# EAGLE schematic alltogether_8.2_4w (EAGLE 9.1.0), part 3 of 3
## Sheet 29 of 31
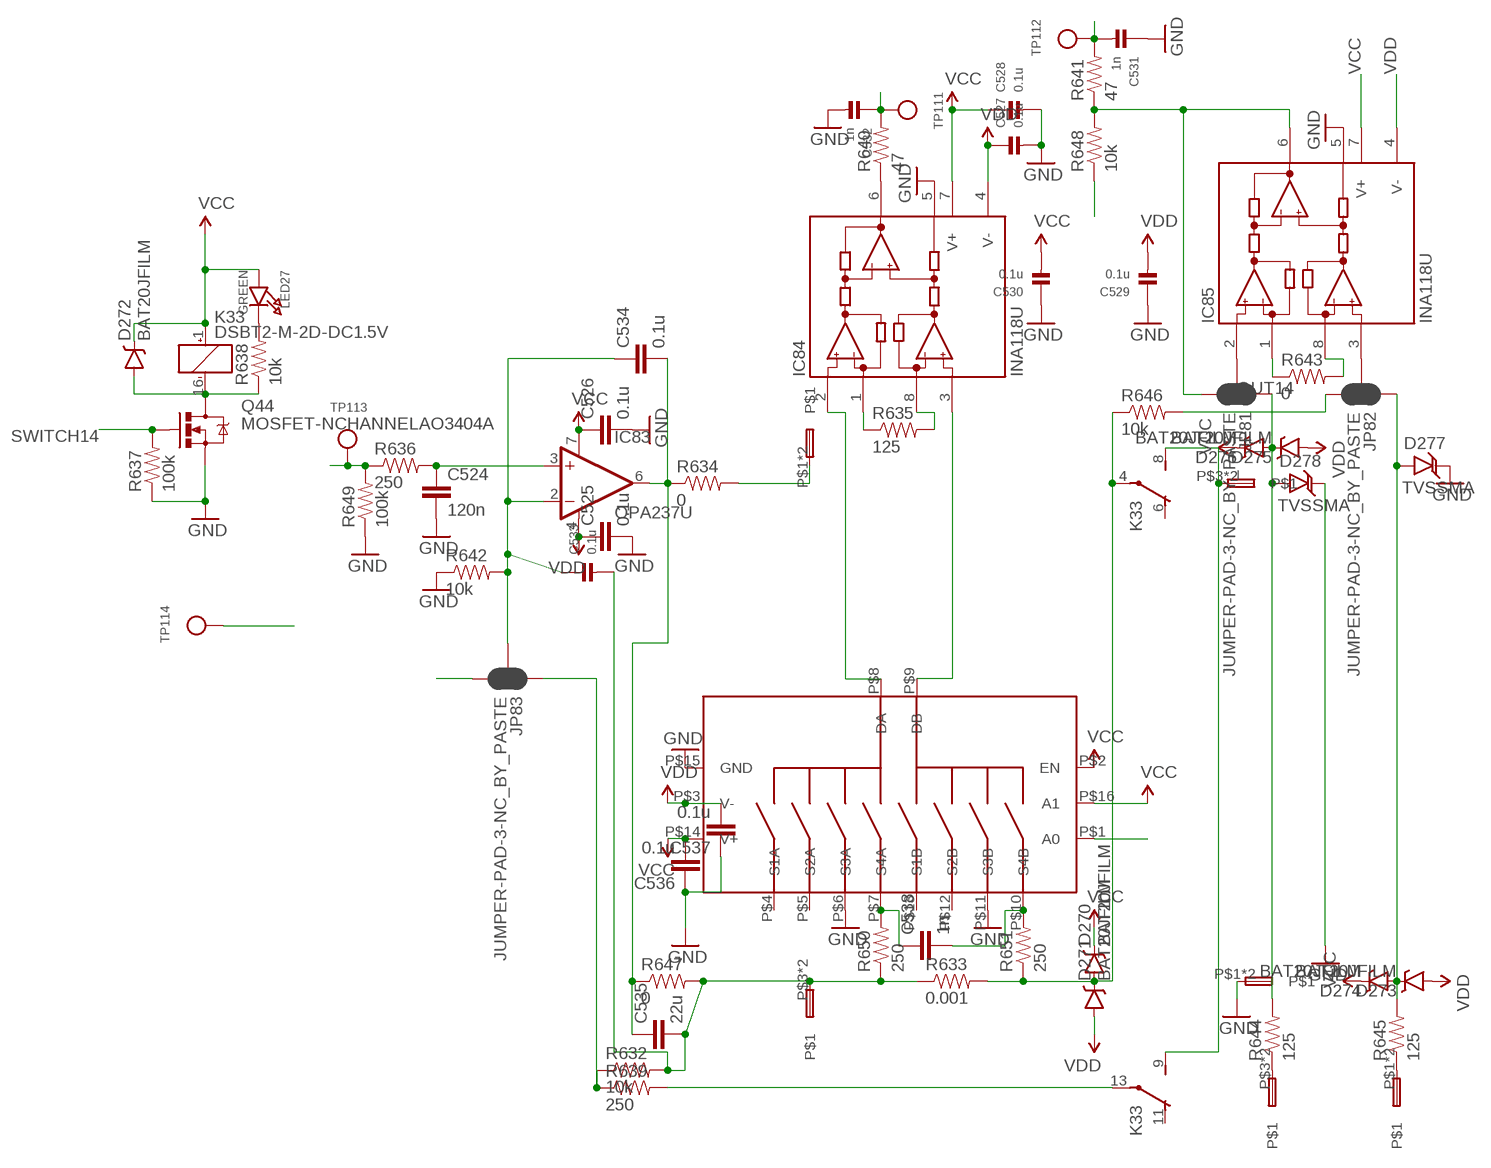
[diagram p28: schematic, sheet 29]

### Parts
C524  120n  CAP0402-CAP  [0402-CAP]
C525  0.1u  CAP0402-CAP  [0402-CAP]
C526  0.1u  CAP0402-CAP  [0402-CAP]
C527  0.1u  CAP_CERAMIC0402  [0402]
C528  0.1u  CAP_CERAMIC0402  [0402]
C529  0.1u  CAP_CERAMIC0402  [0402]
C530  0.1u  CAP_CERAMIC0402  [0402]
C531  1n  CAP_CERAMIC0402  [0402]
C532  1n  CAP_CERAMIC0402  [0402]
C533  0.1u  CAP_CERAMIC0402  [0402]
C534  0.1u  CAP0603-CAP  [0603-CAP]
C535  22u  CAP0805  [0805]
C536  0.1u  CAP0402-CAP  [0402-CAP]
C537  0.1u  CAP0402-CAP  [0402-CAP]
C538  1n  CAP0402-CAP  [0402-CAP]
D270  BAT20JFILM  [SOD-323]
D271  BAT20JFILM  [SOD-323]
D272  BAT20JFILM  [SOD-323]
D273  BAT20JFILM  [SOD-323]
D274  BAT20JFILM  [SOD-323]
D275  BAT20JFILM  [SOD-323]
D276  BAT20JFILM  [SOD-323]
D277  TVSSMA  [SMA-DIODE]
D278  TVSSMA  [SMA-DIODE]
IC83  OPA237U  [SO08]
IC84  INA118U  [SO08]
IC85  INA118U  [SO08]
JP81  JUMPER-PAD-3-NC_BY_PASTE  [PAD-JUMPER-3-NC_BY_PASTE_YES_SILK_FULL_BOX]
JP82  JUMPER-PAD-3-NC_BY_PASTE  [PAD-JUMPER-3-NC_BY_PASTE_YES_SILK_FULL_BOX]
JP83  JUMPER-PAD-3-NC_BY_PASTE  [PAD-JUMPER-3-NC_BY_PASTE_YES_SILK_FULL_BOX]
K33  DSBT2-M-2D-DC1.5V  [DS-BT]
LED27  GREEN  LED0603  [CHIPLED_0603]
Q44  MOSFET-NCHANNELAO3404A  [SOT23-3]
R632  10k  RESISTOR0402-RES  [0402-RES]
R633  0.001  0.001OHM-3W-1%(2512)3W/1%  [2512]
R634  0  RESISTOR0402-RES  [0402-RES]
R635  125  RESISTOR1206  [1206]
R636  250  RESISTOR0402-RES  [0402-RES]
R637  100k  RESISTOR0402-RES  [0402-RES]
R638  10k  RESISTOR0402-RES  [0402-RES]
R639  250  RESISTOR0402-RES  [0402-RES]
R640  47  RESISTOR0402-RES  [0402-RES]
R641  47  RESISTOR0402-RES  [0402-RES]
R642  10k  RESISTOR0402-RES  [0402-RES]
R643  0  RESISTOR1206  [1206]
R644  125  RESISTOR0402-RES  [0402-RES]
R645  125  RESISTOR0402-RES  [0402-RES]
R646  10k  RESISTOR0402-RES  [0402-RES]
R647  0  RESISTOR0805-RES  [0805]
R648  10k  RESISTOR0402-RES  [0402-RES]
R649  100k  RESISTOR0402-RES  [0402-RES]
R650  250  RESISTOR0402-RES  [0402-RES]
R651  250  RESISTOR0402-RES  [0402-RES]
TP111  TESTPOINT0.1"  [1X01_ROUND]
TP112  TESTPOINT0.1"  [1X01_ROUND]
TP113  TESTPOINT0.1"  [1X01_ROUND]
TP114  TESTPOINT0.1"  [1X01_ROUND]
U$119  SPTAF1/2-3.5  [SPTAF1/2-3.5]
U$120  SPTAF1/2-3.5  [SPTAF1/2-3.5]
U$121  SPTAF1/2-3.5  [SPTAF1/2-3.5]
U$122  MUX509  [R-PDSO-G16]

### Nets
A0: TP114.1 U$122.P$1(A0) ; also sheet 2,16,17,18,19,20,21,22,23,24,25,26,27,28,30,31
DAC14: R636.1 R649.2 TP113.1 ; also sheet 9
FB14: JP83.3 R648.1
GND: C524.2 C525.2 C526.2 C527.2 C528.2 C529.1 C530.1 C531.1 C532.2 C536.1 C537.1 D277.C D278.C IC84.5(REF) IC85.5(REF) Q44.2(S) R637.1 R642.1 R649.1 U$120.P$1 U$120.P$2 U$122.P$6(S3A) U$122.P$11(S3B) U$122.P$15(GND) ; also sheet 1,2,3,4,5,6,7,8,9,10,11,12,13,15,16,17,18,19,20,21,22,23,24,25,26,27,28,30,31
N$845: D270.A D271.C K33.4(2:P) R633.2 R646.1 R651.1
N$846: K33.13(3:P) R639.2
N$847: IC84.1(RG) R635.1
N$848: IC84.8(RG) R635.2
N$849: C524.1 IC83.3(+IN) R636.2
N$850: D272.A K33.16(1:-) Q44.3(D) R638.1
N$851: LED27.C R638.2
N$852: C533.1 C534.1 IC83.2(-IN) JP83.2 R642.2
N$853: C533.2 C535.2 R632.2 R633.1 R647.2 R650.1 U$119.P$3 U$119.P$4
N$854: IC84.6(OUT) R640.1
N$855: IC85.6(OUT) JP81.3 R641.1 R648.2
N$856: C534.2 C535.1 IC83.6(OUT) R634.1 R647.1
N$857: IC85.1(RG) R643.1
N$858: IC85.8(RG) R643.2
N$859: IC85.2(-IN) JP81.2
N$860: IC85.3(+IN) JP82.2
N$861: D275.C D276.A D278.A JP81.1 R644.2
N$862: R644.1 U$121.P$3 U$121.P$4
N$863: D273.C D274.A D277.A JP82.1 R645.2
N$864: R645.1 U$121.P$1 U$121.P$2
N$865: JP82.3 R646.2
N$866: JP83.1 R632.1 R639.1
N$867: R634.2 U$119.P$1 U$119.P$2
N$868: IC84.2(-IN) U$122.P$8(DA)
N$869: IC84.3(+IN) U$122.P$9(DB)
N$870: C538.2 R651.2 U$122.P$10(S4B)
N$871: C538.1 R650.2 U$122.P$7(S4A)
OUT14: K33.8(2:S) K33.9(3:S) U$120.P$3 U$120.P$4
SENSEI14: C532.1 R640.2 TP111.1 ; also sheet 7
SENSEV14: C531.2 R641.2 TP112.1 ; also sheet 7
SWITCH14: Q44.1(G) R637.2 ; also sheet 6
VCC: C526.1 C528.1 C530.2 C536.2 D270.C D272.C D274.C D276.C IC83.7(V+) IC84.7(V+) IC85.7(V+) K33.1(1:+) LED27.A U$122.P$2(EN) U$122.P$14(V+) U$122.P$16(A1) ; also sheet 1,2,3,7,8,11,13,15,16,17,18,19,20,21,22,23,24,25,26,27,28,30,31
VDD: C525.1 C527.1 C529.2 C537.2 D271.A D273.A D275.A IC83.4(V-) IC84.4(V-) IC85.4(V-) U$122.P$3(V-) ; also sheet 1,3,7,8,15,16,17,18,19,20,21,22,23,24,25,26,27,28,30,31
Unconnected: K33.6(2:O) K33.11(3:O) U$122.P$4(S1A) U$122.P$5(S2A) U$122.P$12(S2B) U$122.P$13(S1B)

## Sheet 30 of 31
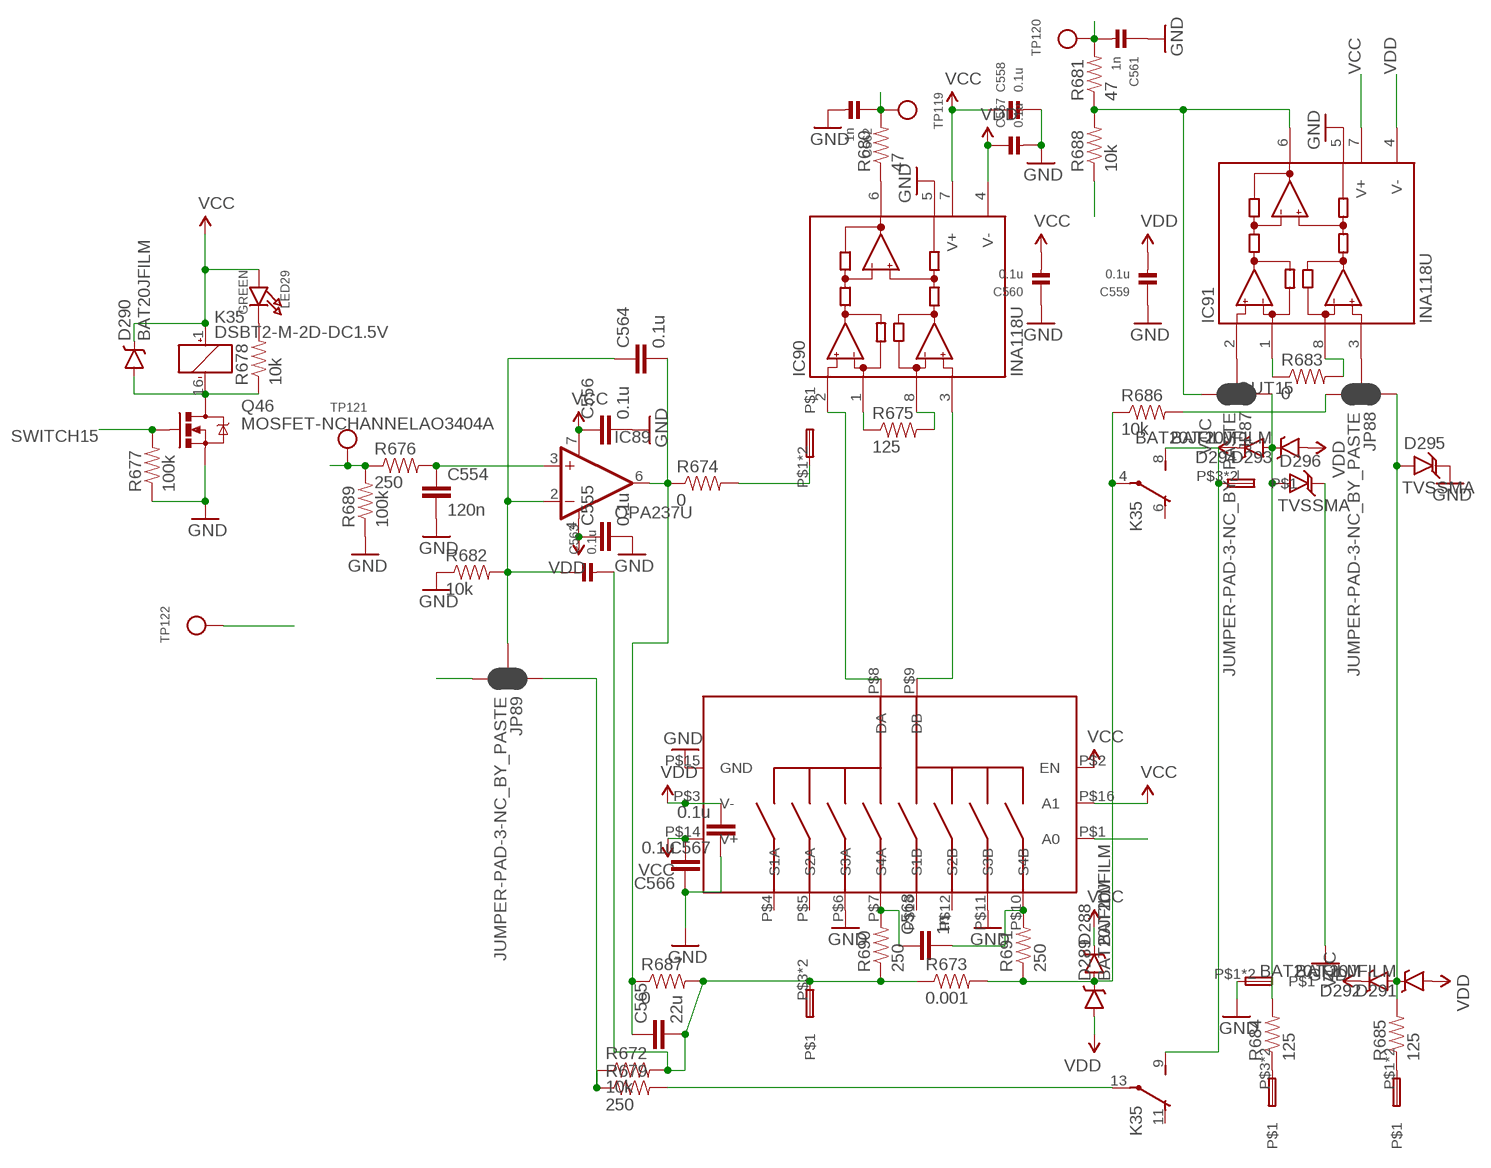
[diagram p29: schematic, sheet 30]

### Parts
C554  120n  CAP0402-CAP  [0402-CAP]
C555  0.1u  CAP0402-CAP  [0402-CAP]
C556  0.1u  CAP0402-CAP  [0402-CAP]
C557  0.1u  CAP_CERAMIC0402  [0402]
C558  0.1u  CAP_CERAMIC0402  [0402]
C559  0.1u  CAP_CERAMIC0402  [0402]
C560  0.1u  CAP_CERAMIC0402  [0402]
C561  1n  CAP_CERAMIC0402  [0402]
C562  1n  CAP_CERAMIC0402  [0402]
C563  0.1u  CAP_CERAMIC0402  [0402]
C564  0.1u  CAP0603-CAP  [0603-CAP]
C565  22u  CAP0805  [0805]
C566  0.1u  CAP0402-CAP  [0402-CAP]
C567  0.1u  CAP0402-CAP  [0402-CAP]
C568  1n  CAP0402-CAP  [0402-CAP]
D288  BAT20JFILM  [SOD-323]
D289  BAT20JFILM  [SOD-323]
D290  BAT20JFILM  [SOD-323]
D291  BAT20JFILM  [SOD-323]
D292  BAT20JFILM  [SOD-323]
D293  BAT20JFILM  [SOD-323]
D294  BAT20JFILM  [SOD-323]
D295  TVSSMA  [SMA-DIODE]
D296  TVSSMA  [SMA-DIODE]
IC89  OPA237U  [SO08]
IC90  INA118U  [SO08]
IC91  INA118U  [SO08]
JP87  JUMPER-PAD-3-NC_BY_PASTE  [PAD-JUMPER-3-NC_BY_PASTE_YES_SILK_FULL_BOX]
JP88  JUMPER-PAD-3-NC_BY_PASTE  [PAD-JUMPER-3-NC_BY_PASTE_YES_SILK_FULL_BOX]
JP89  JUMPER-PAD-3-NC_BY_PASTE  [PAD-JUMPER-3-NC_BY_PASTE_YES_SILK_FULL_BOX]
K35  DSBT2-M-2D-DC1.5V  [DS-BT]
LED29  GREEN  LED0603  [CHIPLED_0603]
Q46  MOSFET-NCHANNELAO3404A  [SOT23-3]
R672  10k  RESISTOR0402-RES  [0402-RES]
R673  0.001  0.001OHM-3W-1%(2512)3W/1%  [2512]
R674  0  RESISTOR0402-RES  [0402-RES]
R675  125  RESISTOR1206  [1206]
R676  250  RESISTOR0402-RES  [0402-RES]
R677  100k  RESISTOR0402-RES  [0402-RES]
R678  10k  RESISTOR0402-RES  [0402-RES]
R679  250  RESISTOR0402-RES  [0402-RES]
R680  47  RESISTOR0402-RES  [0402-RES]
R681  47  RESISTOR0402-RES  [0402-RES]
R682  10k  RESISTOR0402-RES  [0402-RES]
R683  0  RESISTOR1206  [1206]
R684  125  RESISTOR0402-RES  [0402-RES]
R685  125  RESISTOR0402-RES  [0402-RES]
R686  10k  RESISTOR0402-RES  [0402-RES]
R687  0  RESISTOR0805-RES  [0805]
R688  10k  RESISTOR0402-RES  [0402-RES]
R689  100k  RESISTOR0402-RES  [0402-RES]
R690  250  RESISTOR0402-RES  [0402-RES]
R691  250  RESISTOR0402-RES  [0402-RES]
TP119  TESTPOINT0.1"  [1X01_ROUND]
TP120  TESTPOINT0.1"  [1X01_ROUND]
TP121  TESTPOINT0.1"  [1X01_ROUND]
TP122  TESTPOINT0.1"  [1X01_ROUND]
U$127  SPTAF1/2-3.5  [SPTAF1/2-3.5]
U$128  SPTAF1/2-3.5  [SPTAF1/2-3.5]
U$129  SPTAF1/2-3.5  [SPTAF1/2-3.5]
U$130  MUX509  [R-PDSO-G16]

### Nets
A0: TP122.1 U$130.P$1(A0) ; also sheet 2,16,17,18,19,20,21,22,23,24,25,26,27,28,29,31
DAC15: R676.1 R689.2 TP121.1 ; also sheet 9
FB15: JP89.3 R688.1
GND: C554.2 C555.2 C556.2 C557.2 C558.2 C559.1 C560.1 C561.1 C562.2 C566.1 C567.1 D295.C D296.C IC90.5(REF) IC91.5(REF) Q46.2(S) R677.1 R682.1 R689.1 U$128.P$1 U$128.P$2 U$130.P$6(S3A) U$130.P$11(S3B) U$130.P$15(GND) ; also sheet 1,2,3,4,5,6,7,8,9,10,11,12,13,15,16,17,18,19,20,21,22,23,24,25,26,27,28,29,31
N$899: D288.A D289.C K35.4(2:P) R673.2 R686.1 R691.1
N$900: K35.13(3:P) R679.2
N$901: IC90.1(RG) R675.1
N$902: IC90.8(RG) R675.2
N$903: C554.1 IC89.3(+IN) R676.2
N$904: D290.A K35.16(1:-) Q46.3(D) R678.1
N$905: LED29.C R678.2
N$906: C563.1 C564.1 IC89.2(-IN) JP89.2 R682.2
N$907: C563.2 C565.2 R672.2 R673.1 R687.2 R690.1 U$127.P$3 U$127.P$4
N$908: IC90.6(OUT) R680.1
N$909: IC91.6(OUT) JP87.3 R681.1 R688.2
N$910: C564.2 C565.1 IC89.6(OUT) R674.1 R687.1
N$911: IC91.1(RG) R683.1
N$912: IC91.8(RG) R683.2
N$913: IC91.2(-IN) JP87.2
N$914: IC91.3(+IN) JP88.2
N$915: D293.C D294.A D296.A JP87.1 R684.2
N$916: R684.1 U$129.P$3 U$129.P$4
N$917: D291.C D292.A D295.A JP88.1 R685.2
N$918: R685.1 U$129.P$1 U$129.P$2
N$919: JP88.3 R686.2
N$920: JP89.1 R672.1 R679.1
N$921: R674.2 U$127.P$1 U$127.P$2
N$922: IC90.2(-IN) U$130.P$8(DA)
N$923: IC90.3(+IN) U$130.P$9(DB)
N$924: C568.2 R691.2 U$130.P$10(S4B)
N$925: C568.1 R690.2 U$130.P$7(S4A)
OUT15: K35.8(2:S) K35.9(3:S) U$128.P$3 U$128.P$4
SENSEI15: C562.1 R680.2 TP119.1 ; also sheet 7
SENSEV15: C561.2 R681.2 TP120.1 ; also sheet 7
SWITCH15: Q46.1(G) R677.2 ; also sheet 6
VCC: C556.1 C558.1 C560.2 C566.2 D288.C D290.C D292.C D294.C IC89.7(V+) IC90.7(V+) IC91.7(V+) K35.1(1:+) LED29.A U$130.P$2(EN) U$130.P$14(V+) U$130.P$16(A1) ; also sheet 1,2,3,7,8,11,13,15,16,17,18,19,20,21,22,23,24,25,26,27,28,29,31
VDD: C555.1 C557.1 C559.2 C567.2 D289.A D291.A D293.A IC89.4(V-) IC90.4(V-) IC91.4(V-) U$130.P$3(V-) ; also sheet 1,3,7,8,15,16,17,18,19,20,21,22,23,24,25,26,27,28,29,31
Unconnected: K35.6(2:O) K35.11(3:O) U$130.P$4(S1A) U$130.P$5(S2A) U$130.P$12(S2B) U$130.P$13(S1B)

## Sheet 31 of 31
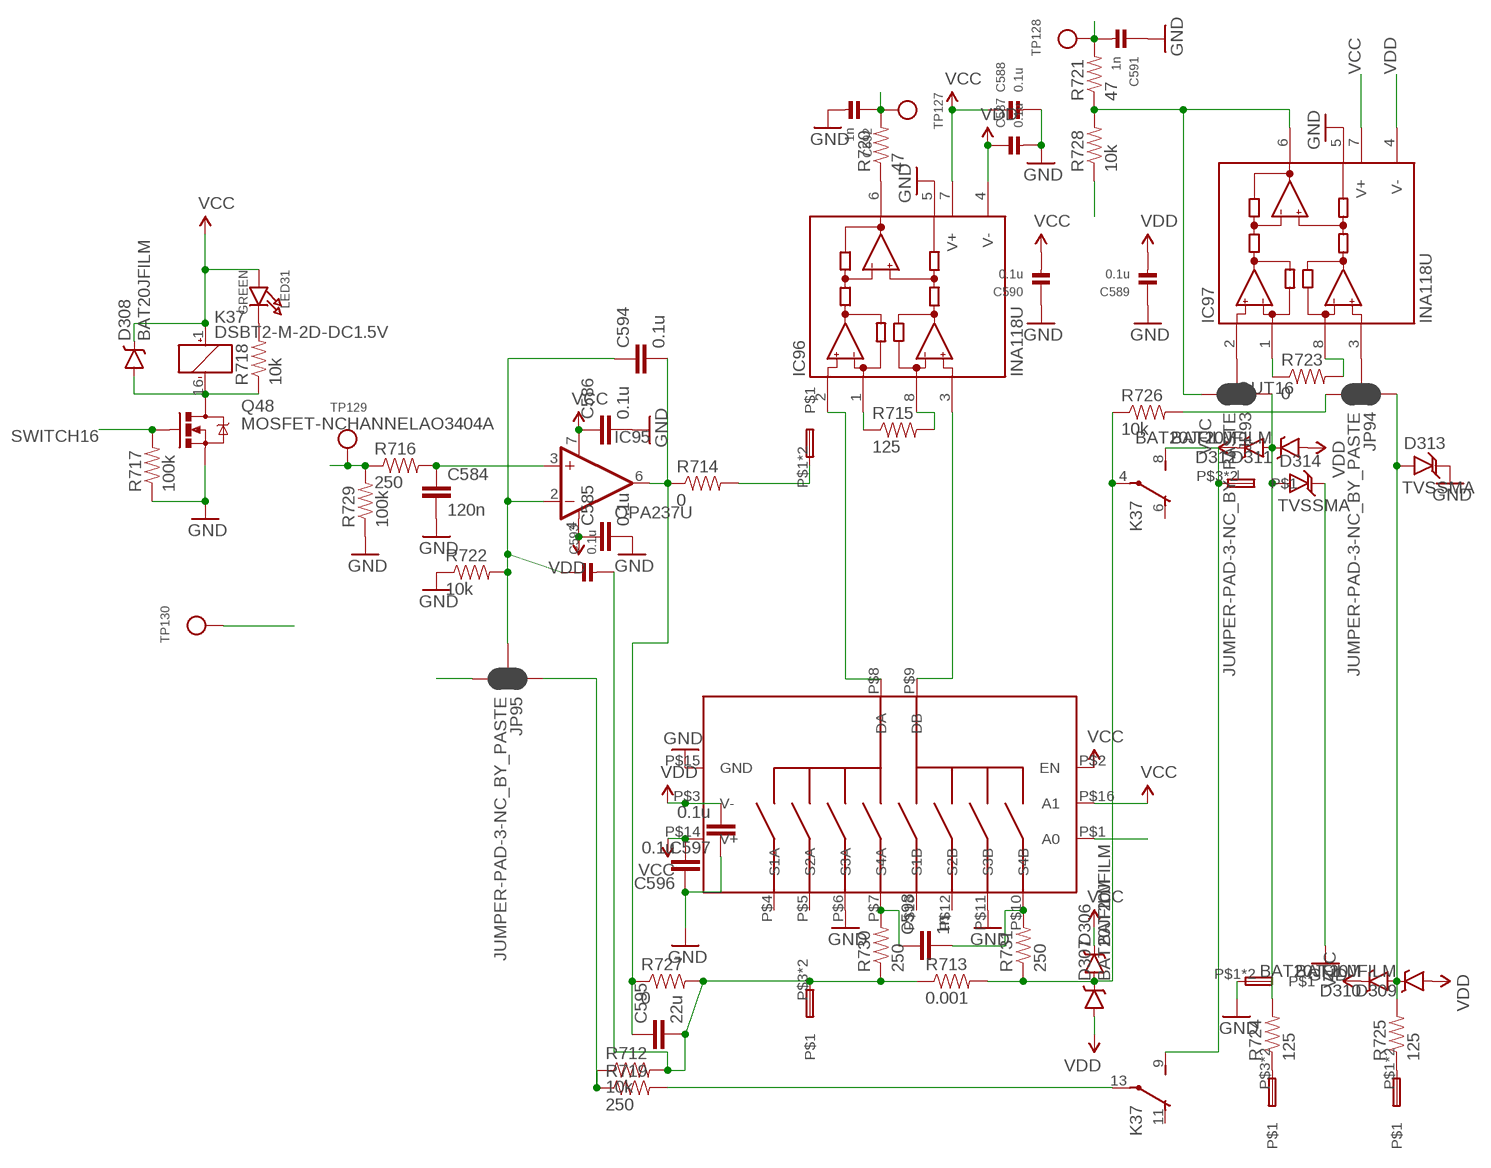
[diagram p30: schematic, sheet 31]

### Parts
C584  120n  CAP0402-CAP  [0402-CAP]
C585  0.1u  CAP0402-CAP  [0402-CAP]
C586  0.1u  CAP0402-CAP  [0402-CAP]
C587  0.1u  CAP_CERAMIC0402  [0402]
C588  0.1u  CAP_CERAMIC0402  [0402]
C589  0.1u  CAP_CERAMIC0402  [0402]
C590  0.1u  CAP_CERAMIC0402  [0402]
C591  1n  CAP_CERAMIC0402  [0402]
C592  1n  CAP_CERAMIC0402  [0402]
C593  0.1u  CAP_CERAMIC0402  [0402]
C594  0.1u  CAP0603-CAP  [0603-CAP]
C595  22u  CAP0805  [0805]
C596  0.1u  CAP0402-CAP  [0402-CAP]
C597  0.1u  CAP0402-CAP  [0402-CAP]
C598  1n  CAP0402-CAP  [0402-CAP]
D306  BAT20JFILM  [SOD-323]
D307  BAT20JFILM  [SOD-323]
D308  BAT20JFILM  [SOD-323]
D309  BAT20JFILM  [SOD-323]
D310  BAT20JFILM  [SOD-323]
D311  BAT20JFILM  [SOD-323]
D312  BAT20JFILM  [SOD-323]
D313  TVSSMA  [SMA-DIODE]
D314  TVSSMA  [SMA-DIODE]
IC95  OPA237U  [SO08]
IC96  INA118U  [SO08]
IC97  INA118U  [SO08]
JP93  JUMPER-PAD-3-NC_BY_PASTE  [PAD-JUMPER-3-NC_BY_PASTE_YES_SILK_FULL_BOX]
JP94  JUMPER-PAD-3-NC_BY_PASTE  [PAD-JUMPER-3-NC_BY_PASTE_YES_SILK_FULL_BOX]
JP95  JUMPER-PAD-3-NC_BY_PASTE  [PAD-JUMPER-3-NC_BY_PASTE_YES_SILK_FULL_BOX]
K37  DSBT2-M-2D-DC1.5V  [DS-BT]
LED31  GREEN  LED0603  [CHIPLED_0603]
Q48  MOSFET-NCHANNELAO3404A  [SOT23-3]
R712  10k  RESISTOR0402-RES  [0402-RES]
R713  0.001  0.001OHM-3W-1%(2512)3W/1%  [2512]
R714  0  RESISTOR0402-RES  [0402-RES]
R715  125  RESISTOR1206  [1206]
R716  250  RESISTOR0402-RES  [0402-RES]
R717  100k  RESISTOR0402-RES  [0402-RES]
R718  10k  RESISTOR0402-RES  [0402-RES]
R719  250  RESISTOR0402-RES  [0402-RES]
R720  47  RESISTOR0402-RES  [0402-RES]
R721  47  RESISTOR0402-RES  [0402-RES]
R722  10k  RESISTOR0402-RES  [0402-RES]
R723  0  RESISTOR1206  [1206]
R724  125  RESISTOR0402-RES  [0402-RES]
R725  125  RESISTOR0402-RES  [0402-RES]
R726  10k  RESISTOR0402-RES  [0402-RES]
R727  0  RESISTOR0805-RES  [0805]
R728  10k  RESISTOR0402-RES  [0402-RES]
R729  100k  RESISTOR0402-RES  [0402-RES]
R730  250  RESISTOR0402-RES  [0402-RES]
R731  250  RESISTOR0402-RES  [0402-RES]
TP127  TESTPOINT0.1"  [1X01_ROUND]
TP128  TESTPOINT0.1"  [1X01_ROUND]
TP129  TESTPOINT0.1"  [1X01_ROUND]
TP130  TESTPOINT0.1"  [1X01_ROUND]
U$135  SPTAF1/2-3.5  [SPTAF1/2-3.5]
U$136  SPTAF1/2-3.5  [SPTAF1/2-3.5]
U$137  SPTAF1/2-3.5  [SPTAF1/2-3.5]
U$138  MUX509  [R-PDSO-G16]

### Nets
A0: TP130.1 U$138.P$1(A0) ; also sheet 2,16,17,18,19,20,21,22,23,24,25,26,27,28,29,30
DAC16: R716.1 R729.2 TP129.1 ; also sheet 9
FB16: JP95.3 R728.1
GND: C584.2 C585.2 C586.2 C587.2 C588.2 C589.1 C590.1 C591.1 C592.2 C596.1 C597.1 D313.C D314.C IC96.5(REF) IC97.5(REF) Q48.2(S) R717.1 R722.1 R729.1 U$136.P$1 U$136.P$2 U$138.P$6(S3A) U$138.P$11(S3B) U$138.P$15(GND) ; also sheet 1,2,3,4,5,6,7,8,9,10,11,12,13,15,16,17,18,19,20,21,22,23,24,25,26,27,28,29,30
N$953: D306.A D307.C K37.4(2:P) R713.2 R726.1 R731.1
N$954: K37.13(3:P) R719.2
N$955: IC96.1(RG) R715.1
N$956: IC96.8(RG) R715.2
N$957: C584.1 IC95.3(+IN) R716.2
N$958: D308.A K37.16(1:-) Q48.3(D) R718.1
N$959: LED31.C R718.2
N$960: C593.1 C594.1 IC95.2(-IN) JP95.2 R722.2
N$961: C593.2 C595.2 R712.2 R713.1 R727.2 R730.1 U$135.P$3 U$135.P$4
N$962: IC96.6(OUT) R720.1
N$963: IC97.6(OUT) JP93.3 R721.1 R728.2
N$964: C594.2 C595.1 IC95.6(OUT) R714.1 R727.1
N$965: IC97.1(RG) R723.1
N$966: IC97.8(RG) R723.2
N$967: IC97.2(-IN) JP93.2
N$968: IC97.3(+IN) JP94.2
N$969: D311.C D312.A D314.A JP93.1 R724.2
N$970: R724.1 U$137.P$3 U$137.P$4
N$971: D309.C D310.A D313.A JP94.1 R725.2
N$972: R725.1 U$137.P$1 U$137.P$2
N$973: JP94.3 R726.2
N$974: JP95.1 R712.1 R719.1
N$975: R714.2 U$135.P$1 U$135.P$2
N$976: IC96.2(-IN) U$138.P$8(DA)
N$977: IC96.3(+IN) U$138.P$9(DB)
N$978: C598.2 R731.2 U$138.P$10(S4B)
N$979: C598.1 R730.2 U$138.P$7(S4A)
OUT16: K37.8(2:S) K37.9(3:S) U$136.P$3 U$136.P$4
SENSEI16: C592.1 R720.2 TP127.1 ; also sheet 7
SENSEV16: C591.2 R721.2 TP128.1 ; also sheet 7
SWITCH16: Q48.1(G) R717.2 ; also sheet 6
VCC: C586.1 C588.1 C590.2 C596.2 D306.C D308.C D310.C D312.C IC95.7(V+) IC96.7(V+) IC97.7(V+) K37.1(1:+) LED31.A U$138.P$2(EN) U$138.P$14(V+) U$138.P$16(A1) ; also sheet 1,2,3,7,8,11,13,15,16,17,18,19,20,21,22,23,24,25,26,27,28,29,30
VDD: C585.1 C587.1 C589.2 C597.2 D307.A D309.A D311.A IC95.4(V-) IC96.4(V-) IC97.4(V-) U$138.P$3(V-) ; also sheet 1,3,7,8,15,16,17,18,19,20,21,22,23,24,25,26,27,28,29,30
Unconnected: K37.6(2:O) K37.11(3:O) U$138.P$4(S1A) U$138.P$5(S2A) U$138.P$12(S2B) U$138.P$13(S1B)

## Library data of the parts
C1-C7 C23-C25 C33-C40 C48-C52 C68-C70 C78-C82 C98-C100 C108-C112 C128-C130 C138-C142 C158-C161 C166 C167 C172 C174 C177-C180 C182-C186 C191 C194 C195 C201 C202 C204 C206-C209 C213-C219 C221-C237 C240 C241 C245 C249 C252 C253 C256-C262 C270-C283 C289-C293 C308 C309 C314-C316 C324-C328 C344-C346 C354-C358 C374-C376 C384-C388 C404-C406 C414-C418 C434-C436 C444-C448 C464-C466 C474-C478 C494-C496 C504-C508 C524-C526 C534-C538 C554-C556 C564-C568 C584-C586 C594-C598 = SparkFun-Capacitors:CAP: Capacitor Standard 0603 ceramic capacitor, and 0.1" leaded capacitor.
C26-C32 C41-C47 C71-C77 C101-C107 C131-C137 C244 C248 C284-C288 C317-C323 C347-C353 C377-C383 C407-C413 C437-C443 C467-C473 C497-C503 C527-C533 C557-C563 C587-C593 = microbuilder:CAP_CERAMIC: Ceramic Capacitors 0402 - 0402 Surface Mount Capacitors 16pF 50V 5% [Digikey: 445-4899-2-ND] 18pF 50V 5% [Digikey: 490-1281-2-ND] 22pF 50V 5% [Digikey: 490-1283-2-ND] 68pF 50V 5% [Digikey: 490-1289-2-ND] 0.1uF 10V 10% [Digikey: 490-1318-2-ND] 1.0uF 6.3V 10% [Digikey: 490-1320-2-ND] 0603 - 0603 Surface Mount Capacitors 16 pF 50V 5% [Digikey: 445-5051-2-ND] 22 pF 50V [Digikey: PCC220ACVTR-ND] 33 pF 50V 5% [Digikey: 490-1415-1-ND] 56pF 50V 5% [Digikey: 490-1421-1-ND] 220pF 50V 5% [Digikey: 445-1285-1-ND] 680 pF 50V 2200 pF 50V 5% C0G [Digikey: 445-1297-1-ND] 5600 pF 100V 5% X7R [Digikey: 478-3711-1-ND] 0.1 µF 25V 10% [Digikey: PCC2277TR-ND] 0.22 µF 16V 10% X7R [Digikey: 445-1318-1-ND] 1.0 µF 25V 10% [Digikey: 445-5146-2-ND] 0603 - RF Specific 3pF 250V +/-0.1pF RF [Digikey: 712-1347-1-ND] 18 pF 250V 5% [Digikey: 478-3505-1-ND or 712-1322-1-ND] 56 pF 250V 5% C0G RF [Digikey: 490-4867-1-ND] 68 pF 250V RF [Digikey: 490-4868-1-ND] 0805 - 0805 Surface Mount Capacitors 220 pF 250V 2% RF Ceramic Capacitor [Digikey: 712-1398-1-ND] 1000 pF 50V 2% NP0 Ceramic Capacitor [Digikey: 478-3760-1-ND] 0.1 µF 25V 10% Ceramic Capacitor [Digikey: PCC1828TR-ND] 1.0 µF 16V 10% Ceramic Capacitor[Digikey: 490-1691-2-ND] 10.0 µF 10V 10% Ceramic Capacitor[Digikey: 709-1228-1-ND] 10.0 uF 16V 10% Ceramic Capacitor [Digikey: 478-5165-2-ND] 47 uF 6.3V 20% Ceramic Capacitor [Digikey: 587-1779-1-ND or 399-5506-1-ND] 1206 - 1206 Surface Mount Capacitors 47uF 10V 20% Ceramic Capacitor [Digikey: 490-5528-1-ND or 399-5508-1-ND or 445-6010-1-ND] 100uF 6.3V -20%, +80% Y5V Ceramic Capacitor (Digikey: 490-4512-1-ND, Mouser: 81-GRM31CF50J107ZE1L)
C162-C165 C168-C171 C173 C175 C176 C181 C187-C190 C192 C193 C196-C200 C203 C205 C210-C212 C220 C254 C255 C263-C269 C310-C312 = SparkFun-Passives:CAP: Capacitor Standard 0603 ceramic capacitor, and 0.1" leaded capacitor.
C238 C239 C246 C247 C250 C251 = norman:CAPACITOR
C242 C243 = SparkFun-Capacitors:CAP_POL: Capacitor Polarized These are standard SMD and PTH capacitors. Normally 10uF, 47uF, and 100uF in electrolytic and tantalum varieties. Always verify the external diameter of the through hole cap, it varies with capacity, voltage, and manufacturer. The EIA devices should be standard.
CN1 CN2 = Arduino-Neutrino-082:CONNETTORI_0171_PH127-205DF055G00A: 2x5 PASSO 1,27; VALUE: PINHEAD-2x5-P1.27
D1-D3 D9-D15 D18-D25 D31-D33 D41-D47 D62-D68 D80-D86 D98-D104 D116-D122 D134-D140 D148-D151 D163 D165 D180-D186 D198-D204 D216-D222 D234-D240 D252-D258 D270-D276 D288-D294 D306-D312 = SparkFun-DiscreteSemi:BAT20JFILM: 23V, 1A Schottky diode, SOD-323 package; PROD_ID: DIO-11623
D16 D17 D26 D27 D51 D52 D69 D70 D87 D88 D105 D106 D123 D124 D141 D142 D159 D160 D187 D188 D205 D206 D223 D224 D241 D242 D259 D260 D277 D278 D295 D296 D313 D314 = SparkFun-DiscreteSemi:TVS: Transient voltage suppressor- prevents ESD on inputs.
D145-D147 = SparkFun-DiscreteSemi:DIODE-SCHOTTKY: Schottky diodes in SFE's production catalog BAT20J 1A 23V 0.62Vf RB751 120mA 40V 0.37Vf PMEG4005EJ 0.5A 40V 0.42Vf MBRA140 1A 40V 0.5Vf B340A 3A 40V SMA; PROD_ID: DIO-11623
D152 D158 D167 D169 = SparkFun-DiscreteSemi:DIODE: Diode These are standard reverse protection diodes and small signal diodes. SMA package can handle up to about 1A. SOD-323 can handle about 200mA. What the SOD-323 package when ordering, there are some mfgs out there that are 5-pin packages.; PROD_ID: DIO-09646
D153-D157 D164 D166 D168 D170-D172 = SparkFun-LED:LED: LEDs Standard schematic elements and footprints for 5mm, 3mm, 1206, and 0603 sized LEDs. 5mm - Spark Fun Electronics SKU : COM-00529 (and others)
D161 D162 = SparkFun-DiscreteSemi:DIODE-SCHOTTKY: Schottky diodes in SFE's production catalog BAT20J 1A 23V 0.62Vf RB751 120mA 40V 0.37Vf PMEG4005EJ 0.5A 40V 0.42Vf MBRA140 1A 40V 0.5Vf B340A 3A 40V SMA; PROD_ID: DIO-09886
F1 F2 = dp_devices:FUSE_PTC: Resettable PTC
FB1-FB3 = microbuilder:FERRITE: Ferrite Bead 0603 MMZ1608B121C - 120 Ohm @ 100MHz, 600mA, 0.15 Ohm DC Resistance - Digikey: 445-2164-1-ND BK1608HW121-T - 120 Ohm, 600mA Ferrite Chip - Digikey: 587-1876-2-ND 0805 HZ0805B272R-10 - 2.7K Ohm @ 100MHz, 200mA, 0.8 Ohm DC Resistance - Digikey: 240-2504-1-ND (see also Murata BLM21BD272SN1L) MMZ2012Y152B - 1.5K Ohm @ 100MHz, 500mA, 0.4 Ohm DC Resistance - Digikey: 445-1560-1-ND - Mainly for high frequency (80-400MHz) MMZ2012R102A - 1K Ohm @ 100MHz, 500mA, 0.3 Ohm DC Resistance - Digikey: 445-1555-2-ND - More general purpose (10-200MHz)
IC2 IC5 IC12 IC18 IC24 IC30 IC36 IC44 IC53 IC59 IC65 IC71 IC77 IC83 IC89 IC95 = burr-brown:OPA237: Operational Amplifiers Single-Supply, MicroAmplifier(TM) Series; MF: TEXAS INSTRUMENT CONNECTORS; MPN: OPA237UA; OC_FARNELL: 1800507; OC_NEWARK: 04M4584
IC3 IC4 IC6-IC8 IC13 IC14 IC19 IC20 IC25 IC26 IC31 IC32 IC37 IC38 IC45 IC46 IC54 IC55 IC60 IC61 IC66 IC67 IC72 IC73 IC78 IC79 IC84 IC85 IC90 IC91 IC96 IC97 = burr-brown:INA118: Instrumentation Amplifier Precision, Low Power; MF: TEXAS INSTRUMENTS; MPN: INA118U; OC_FARNELL: 1212404; OC_NEWARK: 04M6168
IC49 IC51 = maxim:MAX306CWI: MULTIPLEXER; MF: MAXIM; MPN: MAX306CWI; OC_FARNELL: unknown; OC_NEWARK: 90C2555
IC50 = burr-brown:OPA336: CMOS Operational Amplifiers Single-Supply, MicroPower, MicroAmplifier(TM) Series; MPN: OPA336NA; OC_FARNELL: 1212297; OC_NEWARK: 01M8405
J1 = SparkFun-Connectors:M02: Standard 2-pin 0.1" header. Use with - straight break away headers ( PRT-00116) - right angle break away headers (PRT-00553) - swiss pins (PRT-00743) - machine pins (PRT-00117) - female headers (PRT-00115) Molex polarized connector foot print use with: PRT-08233 with associated crimp pins and housings. 2.54_SCREWTERM for use with PRT-10571. 3.5mm Screw Terminal footprints for PRT-08084 5mm Screw Terminal footprints for use with PRT-08432
J3 = SparkFun-Connectors:M05X2: Header 5x2 Standard 10-pin dual row 0.1" header. Commonly used with AVR-ISP. Use with Spark Fun Electronics SKU: PRT-00778
JP2 = SparkFun-Passives:JUMPER-PAD-2-NC_BY_PASTE
JP6-JP11 JP15-JP17 JP21-JP23 JP27-JP29 JP33-JP35 JP39-JP41 JP45-JP47 JP51-JP53 JP57-JP59 JP63-JP65 JP69-JP71 JP75-JP77 JP81-JP83 JP87-JP89 JP93-JP95 = SparkFun-Passives:JUMPER-PAD-3-NC_BY_PASTE
K1 K2 K4 K6 K8 K10 K12 K14 K23 K25 K27 K29 K31 K33 K35 K37 = relay:DSBT2-*: DS-BT RELAYS 4,000 V BREAKDOWN VOLTAGE NAiS Source: http://www.mew-europe.com/.. en_ds_61005_0010.pdf; OC_FARNELL: unknown; OC_NEWARK: unknown
K3 K18 = relay:AQW*: PhotoMOS Relay NAiS Source: http://www.mew-europe.com/.. pti_en.pdf; OC_FARNELL: unknown; OC_NEWARK: unknown
K5 K7 K19-K22 = relay:RT42?*: Power PCB Relay SCHRACK 2 pole 8 A, DC and AC-coil Source: http://www.schrack.com/.. 5842.pdf; MPN: RT424005; OC_FARNELL: 1629052; OC_NEWARK: 03P2425
K17 = relay:AQY*: PhotoMOS Relay NAiS Source: http://www.panasonic-electric-works.com/catalogues/downloads/photomos/ds_x615_en_aqz10_20.pdf; OC_FARNELL: unknown; OC_NEWARK: unknown
L2 L3 = murata-filter:COMMONMODEFILTER
L4 L5 = SparkFun-Passives:INDUCTOR: Inductors Basic Inductor/Choke - 0603 and 1206. Footprints are not proven and vary greatly between part numbers. INDUCTOR POWER 3.3UH 4.0A SMD 0.197" L x 0.197" W x 0.177" H (5.00mm x 5.00mm x 4.50mm); PROD_ID: NDUC-10789
LED1 LED2 LED4 LED6 LED8 LED10 LED12 LED15 LED17 LED19 LED21 LED23 LED25 LED27 LED29 LED31 = microbuilder:LED: LED 0603 - 0603 Surface Mount Package 2mA: Green LED - Low Power (3.9mcd, 2ma, 1.7Vf) - Digikey: 475-2709-2-ND Orange LED - Low Power (9.8mcd, 2ma, 1.8Vf) - Digikey: 475-1194-2-ND Red LED - Low Power (5mcd, 2ma, 1.8Vf) - Digikey: 475-1195-2-ND Yellow LED - Low Power (7mcd, 2ma, 1.8Vf) - Digikey: 475-1196-2-ND 5mA: Blue LED - Low Power (17mcd, 5ma, 2.9Vf) - Digikey: LNJ937W8CRACT-ND 0805 - 0805 Surface Mount Package 2mA: Red LED (8.8mcd, 2mA, 1.8Vf, Clear) - Low Power [Digikey: 475-2510-1-ND] Green LED (5mcd, 2mA, 1.8Vf, Clear) - Low Power [Digikey: 475-2730-1-ND] Yellow LED (11.3mcd, 2mA, 1.8Vf, Clear) - Low Power [Digikey: 475-2555-1-ND] 20mA: Red LED (104mcd, 20mA, Diffused) - LS R976 [Digikey: 475-1278-6-ND] Red LED (12mcd, 20mA, 2.0Vf, Clear) - APT2012EC [Digikey: 754-1128-1-ND] Green LED (15mcd, 20mA, 2.2Vf, Clear) - APT2012GC [Digikey: 754-1131-1-ND] Orange LED (160mcd, 20mA, 2.1Vf, Clear) - APT2012SECK [Digikey: 754-1130-1-ND] 1206 - 1206 Surface Mount Package Green LED (26mcd, 20mA, Diffused) - LG N971 [Digikey: 475-1407-6-ND] Red LED (15mcd, 20mA, Diffused) - LH N974 [Digikey: 475-1416-6-ND]
Q1 Q2 Q4 Q6 Q8 Q10 Q12 Q15 Q17 Q18 Q20-Q22 Q28 Q29 Q31-Q34 Q36 Q38 Q40 Q42 Q44 Q46 Q48 = SparkFun-DiscreteSemi:MOSFET-NCHANNEL: Common NMOSFET Parts MFG P/N Store ID Prod ID FDD8780 TRANS-09984 SI7820DN TRANS-11055 FDS6630A IC-08089 2N7002PW TRANS-11151 FQP30N06L COM-10213 TRANS-10060 BSS123LT1G TRANS-08345 BSS138 TRANS-00830 BS170 2N7000; PROD_ID: TRAN-12988
Q19 Q26 = crystal:FC-12M: kHz RANGE CRYSTAL UNIT LOW PROFILE SMD Source: Epson Toyocom FC-12M.pdf
Q23 = GeekAmmo:N-CHANNEL-MOSFET: N-Channel MOSFET Mode Field Effect Transistor; DATASHEET: http://www.fairchildsemi.com/ds/BS/BSS138.pdf; DIGIKEY: BSS138TR-ND; ELEMENT14: 2323154; URL: http://au.element14.com/fairchild-semiconductor/bss138/mosfet-n-ch-50v-220ma-sot-23/dp/2323154
Q24 Q25 = SparkFun-DiscreteSemi:TRANSISTOR_NPN: Generic NPN BJT MMBT2222A - TRANS-08049 (SOT-23, 1A 40V) MPSA42 - TRANS-09116 (SOT-23, 500mA 300V) MMBT5088LT1G - TRANS-11160 (SOT-23, 50 mA 30V) BC547 - COM-08928 <http://www.sparkfun.com/products/8928> (TO-92 45V 100mA) (1.Collector 2.Base 3.Emitter) 2N3904 - COM-00521 <http://www.sparkfun.com/products/521> (TO-92 40V 200mA) (1.Emitter 2.Base 3.Collector) P2N2222A - COM-12852 <http://www.sparkfun.com/products/12852> (TO-92 40V 600mA) (1.Collector 2.Base 3.Emitter); PROD_ID: TRANS-11160
Q27 = GeekAmmo:P-CHANNEL-MOSFET: P-Channel MOSFET Mode Field Effect Transistor
Q30 = SparkFun-DiscreteSemi:MOSFET-NCHANNEL: Common NMOSFET Parts MFG P/N Store ID Prod ID FDD8780 TRANS-09984 SI7820DN TRANS-11055 FDS6630A IC-08089 2N7002PW TRANS-11151 FQP30N06L COM-10213 TRANS-10060 BSS123LT1G TRANS-08345 BSS138 TRANS-00830 BS170 2N7000; PROD_ID: TRANS-09984
R1-R10 R17 R18 R29 R31 R33-R40 R42-R50 R52 R54-R60 R62-R72 R95 R97 R99-R105 R107-R114 R135 R137 R139-R145 R147-R154 R175 R177 R179-R185 R187-R194 R215 R217 R219-R225 R227-R234 R257-R278 R280 R282-R332 R334-R361 R369-R377 R391 R393 R395-R401 R403-R410 R431 R433 R435-R441 R443-R450 R459 R472 R474 R476-R482 R484-R491 R512 R514 R516-R522 R524-R531 R552 R554 R556-R562 R564-R571 R592 R594 R596-R602 R604-R611 R632 R634 R636-R642 R644-R651 R672 R674 R676-R682 R684-R691 R712 R714 R716-R722 R724-R731 = SparkFun-Passives:RESISTOR: Resistor Basic schematic elements and footprints for 0603, 1206, and PTH resistors.
R13-R16 R32 R41 R53 R61 R98 R106 R138 R146 R178 R186 R218 R226 R281 R333 R394 R402 R434 R442 R475 R483 R515 R523 R555 R563 R595 R603 R635 R643 R675 R683 R715 R723 = SparkFun-Resistors:RESISTOR: Resistor Basic schematic elements and footprints for 0603, 1206, and PTH resistors.
R30 R51 R96 R136 R176 R216 R279 R392 R432 R473 R513 R553 R593 R633 R673 R713 = SparkFun-Resistors:0.001OHM-3W-1%(2512); PROD_ID: RES-12449
SW1 = adafruit:SPST_TACT: SMT 6mm switch, EVQQ2 series http://www.ladyada.net/library/eagle
TP1-TP6 = SparkFun-Passives:TEST-POINT: Bare copper test points for troubleshooting or ICT
TP11-TP18 TP23-TP26 TP31-TP34 TP39-TP42 TP47-TP50 TP55-TP58 TP63-TP66 TP71-TP74 TP79-TP82 TP87-TP90 TP95-TP98 TP103-TP106 TP111-TP114 TP119-TP122 TP127-TP130 = microbuilder:TESTPOINT: Test Point Various test points for characterisation and PCB testing TESTPOINT_SMT - Compact Surface Mount Test Point [Digikey: 5016KTR-ND]; BOM: EXCLUDE
TVS1-TVS4 = passives:TVS_DIODE
U1 = texasinstruments:PGA280AIPW: Programmable Gain INSTRUMENTATION AMPLIFIER; MPN: PGA280AIPW; OC_FARNELL: 1771744; OC_NEWARK: 27R0200; PACKAGE: TSSOP-24; SUPPLIER: Texas Instruments
U2 U22 = SparkFun-PowerIC:AP2202-ADJ: AP2202 Adjustable LDO Diodes Inc small, low-cost LDO 150mA, 13.2V, less than 200mV dropout; PROD_ID: VREG-12189
U3 = texasinstruments:ADS1259BIPWR: Analog-to-Digital Converter; MPN: ADS1259BIPWR; OC_FARNELL: -; OC_NEWARK: 72R4952; PACKAGE: TSSOP-20; SUPPLIER: Texas Instruments
U4 U23 = texasinstruments:REF3225AMDBVREPG4: VOLTAGE REFERENCE; MPN: REF3225AMDBVREPG4; OC_FARNELL: -; OC_NEWARK: 09R5103; PACKAGE: SOT-23-6; SUPPLIER: Texas Instruments
U5 U24 = texasinstruments:DAC7718SRGZR: Octal, 12-Bit,DAC
U6 = texasinstruments:TS5A3159ADCKR: SPDT ANALOG SWITCH; MPN: TS5A3159ADCKR; OC_FARNELL: -; OC_NEWARK: 61K1947; PACKAGE: SC-70-6; SUPPLIER: Texas Instruments
U7-U9 = texas:TPS7A30
U10 U14 = SparkFun-DigitalIC:ATSAMD21G: Atmel SAMD21G SMART ARM-Based Microcontroller The Atmel ® | SMART ™ SAM D21 is a series of low-power microcontrollers using the 32-bit ARM ® Cortex ® -M0+ processor, and ranging from 32- to 64-pins with up to 256KB Flash and 32KB of SRAM. The SAM D21 devices operate at a maximum frequency of 48MHz and reach 2.46 CoreMark/MHz. They are designed for simple and intuitive migration with identical peripheral modules, hex compatible code, identical linear address map and pin compatible migration paths between all devices in the product series. All devices include intelligent and flexible peripherals, Atmel Event System for inter-peripheral signaling, and support for capacitive touch button, slider and wheel user interfaces.; PROD_ID: IC-13064
U11 = texasinstruments:ADS1013IDGSR: ADC; MPN: ADS1013IDGSR; OC_FARNELL: -; OC_NEWARK: 55R2407; PACKAGE: MSOP-10; SUPPLIER: Texas Instruments
U12 = dp_devices:IC_MEM_23LC1024: 1Mbit SPI SRAM with Serial dual interface and Serial quad interface
U13 = texasinstruments:SN74LVC1G04DCKT: SINGLE INVERTER GATE; MPN: SN74LVC1G04DCKT; OC_FARNELL: 1470831; OC_NEWARK: 22H0375; PACKAGE: SC-70-5; SUPPLIER: Texas Instruments
U16 = texasinstruments:TMP100NA/3KG4: Digital Temperature Sensor with I2C Interface; MPN: TMP100NA/3KG4; OC_FARNELL: 1207303; OC_NEWARK: 24M8367; PACKAGE: SOT-23-6; SUPPLIER: Texas Instruments
U17 U33 = texasinstruments:PCA9545APW: 4-channel I2C-bus switch with interrupt logic and reset; MPN: PCA9545APW; OC_FARNELL: 1652260; OC_NEWARK: 66K4030; PACKAGE: TSSOP-20; SUPPLIER: Texas Instruments
U18 = SparkFun-PowerIC:V_REG_MIC2920: MIC2920A (http://www.micrel.com/_PDF/mic2920.pdf) - 400mA output LDO Regulator
U19 U38 U39 = texasinstruments:SN74LV595ADRG3: SHIFT REGISTERS; MPN: SN74LV595ADRG3; OC_FARNELL: 1886456; OC_NEWARK: 32T3213; PACKAGE: SOIC-16; SUPPLIER: Texas Instruments
U20 = SparkFun-IC-Power:AP2202-ADJ: AP2202 Adjustable LDO Diodes Inc small, low-cost LDO 150mA, 13.2V, less than 200mV dropout; PROD_ID: VREG-12189
U25 = texasinstruments:ADS1148IPW: 16-Bit Analog-to-Digital Converters for Temperature Sensors
U26 = texasinstruments:LM94022
U34 U35 = texasinstruments:SN74LVC2G08DCUR: DUAL 2-INPUT POSITIVE-AND GATE; MPN: SN74LVC2G08DCUR; OC_FARNELL: 1470869; OC_NEWARK: 67K2861; PACKAGE: VSSOP-8; SUPPLIER: Texas Instruments
U36 = texasinstruments:SN74LVC2G04DCKR: DUAL INVERTER GATE; MPN: SN74LVC2G04DCKR; OC_FARNELL: 1470882; OC_NEWARK: 76C4192; PACKAGE: SC70-6; SUPPLIER: Texas Instruments
U37 = texasinstruments:SN74LVC125APW: QUADRUPLE BUS BUFFER GATE WITH 3-STATE OUTPUTS; MPN: SN74LVC125APW; OC_FARNELL: 1739720; OC_NEWARK: 22H0397; PACKAGE: TSSOP14; SUPPLIER: TEXAS INSTRUMENTS
U$1 = norman:ABMM2
U$5-U$7 U$9 U$10 U$12 U$20-U$22 U$28-U$30 U$37 U$39 U$40 U$46 U$47 U$51 U$57 U$58 U$61 U$71-U$73 U$79-U$81 U$87-U$89 U$95-U$97 U$103-U$105 U$111-U$113 U$119-U$121 U$127-U$129 U$135-U$137 X3 X4 X52 = norman:SPTAF1/2-3.5
U$8 U$14 U$23 U$31 U$41 U$52 U$65 U$74 U$82 U$90 U$98 U$106 U$114 U$122 U$130 U$138 = norman:MUX509
U$11 = norman:PTSA0,5/42,5
U$15 = norman:PRTR5V0U2X
U$48-U$50 U$59 U$60 U$62-U$64 = GeekAmmo:FIDUCIAL
X1 X2 X7-X10 X53-X55 X57 X66 X67 X77 X78 = norman:SPTAF1/4-3.5
X5 X6 X11 X12 = norman:SPTAF1/5-3.5
X56 = SparkFun-Connectors:USB+SHIELD: USB+Shield USB connector with shield pins connectable
X58 = con-phoenix-508:SPTA1.5/2
X59 = con-phoenix-508:SPTA1.5/4
X68 = con-phoenix-350:1751277: MKDS 1/ 5-3,5 Printklemme Nennstrom: 10 A Bemessungsspannung: 160 V Raster: 3,5 mm Polzahl: 5 Montageart: Löten Anschlussart: Schraubanschluss Anschlussrichtung vom Leiter zur Platine: 0° Source: http://eshop.phoenixcontact.com .. 1751277.pdf; OC_FARNELL: unknown; OC_NEWARK: unknown
X73-X76 = con-phoenix-350:1751264: MKDS 1/ 4-3,5 Printklemme Nennstrom: 10 A Bemessungsspannung: 160 V Raster: 3,5 mm Polzahl: 4 Montageart: Löten Anschlussart: Schraubanschluss Anschlussrichtung vom Leiter zur Platine: 0° Source: http://eshop.phoenixcontact.com .. 1751264.pdf; MPN: 1751264; OC_FARNELL: unknown; OC_NEWARK: 10R0934

## Net classes
2 gnd: width 0.152 mm, drill 0.305 mm, clearance 0.152 mm